# EAGLE schematic 1 (EAGLE 9.3.2)
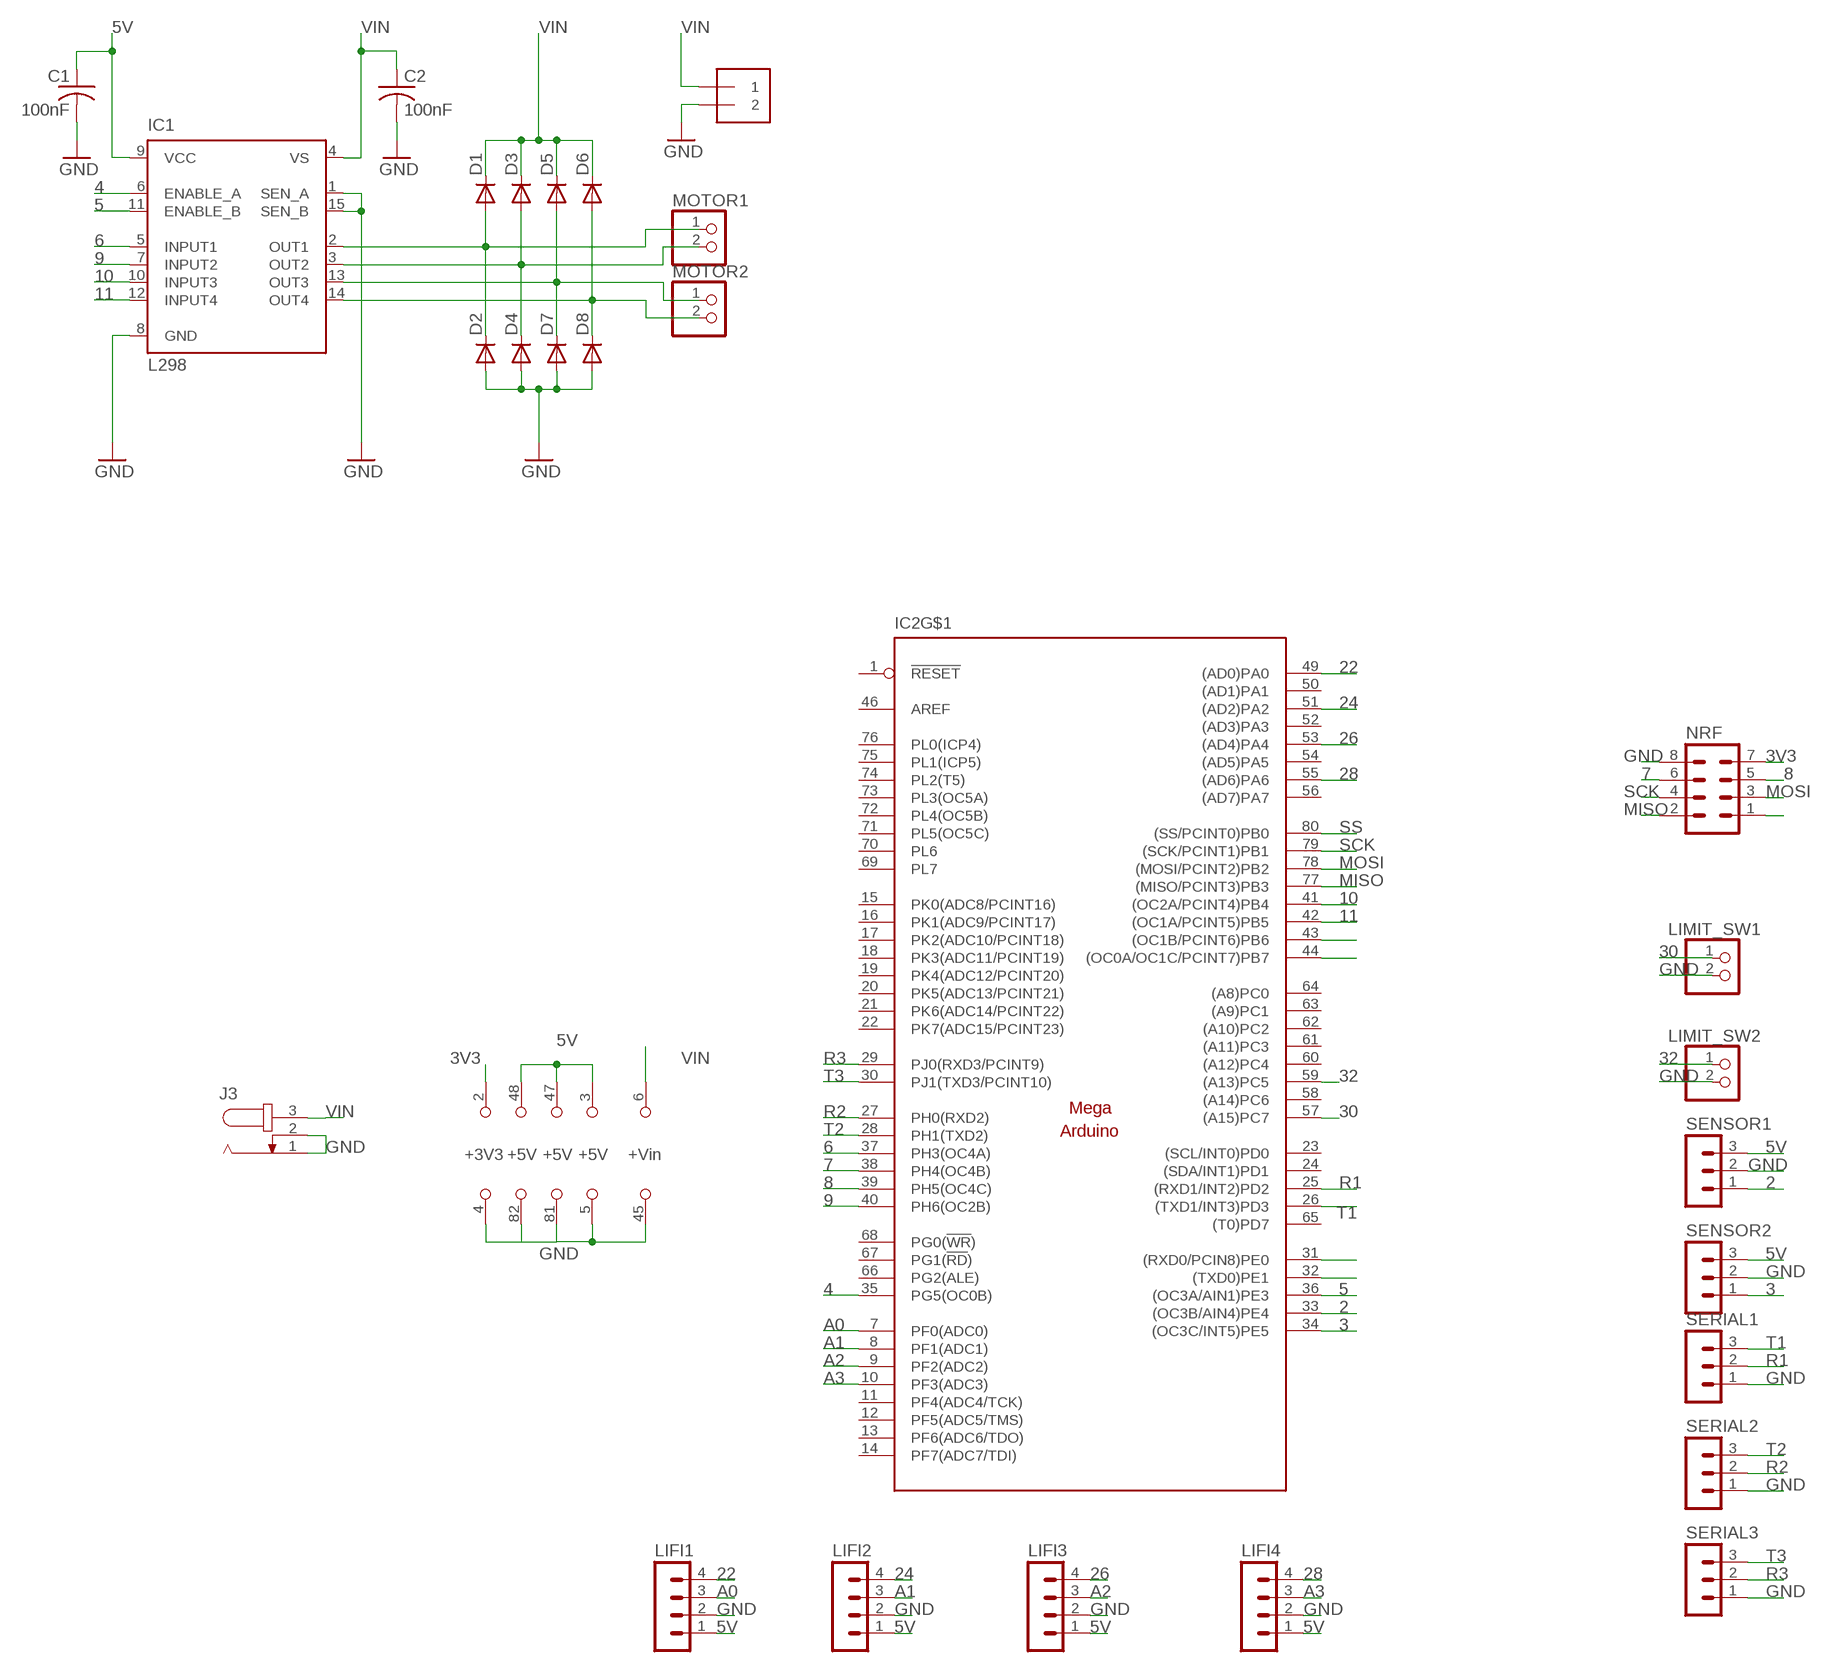
[diagram p0: schematic, sheet 1]

## Parts
C1  100nF  C-US050-024X044  [C050-024X044]
C2  100nF  C-US050-024X044  [C050-024X044]
D1  DIODE-D-5  [D-5]
D2  DIODE-D-5  [D-5]
D3  DIODE-D-5  [D-5]
D4  DIODE-D-5  [D-5]
D5  DIODE-D-5  [D-5]
D6  DIODE-D-5  [D-5]
D7  DIODE-D-5  [D-5]
D8  DIODE-D-5  [D-5]
IC1  L298  [MULTIWATT-15]
IC2  MEGAARDUINO_21  [MEGA_ARDUINO_1]
J1  1X2-3.5MM  [1X2-3.5MM]
J3  JACK-PLUG0  [SPC4077]
LIFI1  MA04-1  [MA04-1]
LIFI2  MA04-1  [MA04-1]
LIFI3  MA04-1  [MA04-1]
LIFI4  MA04-1  [MA04-1]
LIMIT_SW1  PINHD-1X2  [1X02]
LIMIT_SW2  PINHD-1X2  [1X02]
MOTOR1  PINHD-1X2  [1X02]
MOTOR2  PINHD-1X2  [1X02]
NRF  MA04-2  [MA04-2]
SENSOR1  MA03-1  [MA03-1]
SENSOR2  MA03-1  [MA03-1]
SERIAL1  MA03-1  [MA03-1]
SERIAL2  MA03-1  [MA03-1]
SERIAL3  MA03-1  [MA03-1]

## Nets
2: IC2.33((OC3B/AIN4)PE4) SENSOR1.1
3: IC2.34((OC3C/INT5)PE5) SENSOR2.1
3V3: IC2.2(+3V3) NRF.7
4: IC1.6(ENABLE_A) IC2.35(PG5(OC0B))
5: IC1.11(ENABLE_B) IC2.36((OC3A/AIN1)PE3)
5V: C1.1 IC1.9(VCC) IC2.3(+5V) IC2.47(+5V) IC2.48(+5V) LIFI1.1 LIFI2.1 LIFI3.1 LIFI4.1 SENSOR1.3 SENSOR2.3
6: IC1.5(INPUT1) IC2.37(PH3(OC4A))
7: IC2.38(PH4(OC4B)) NRF.6
8: IC2.39(PH5(OC4C)) NRF.5
9: IC1.7(INPUT2) IC2.40(PH6(OC2B))
10: IC1.10(INPUT3) IC2.41((OC2A/PCINT4)PB4)
11: IC1.12(INPUT4) IC2.42((OC1A/PCINT5)PB5)
22: IC2.49((AD0)PA0) LIFI1.4
24: IC2.51((AD2)PA2) LIFI2.4
26: IC2.53((AD4)PA4) LIFI3.4
28: IC2.55((AD6)PA6) LIFI4.4
30: IC2.57((A15)PC7) LIMIT_SW1.1
32: IC2.59((A13)PC5) LIMIT_SW2.1
A0: IC2.7(PF0(ADC0)) LIFI1.3
A1: IC2.8(PF1(ADC1)) LIFI2.3
A2: IC2.9(PF2(ADC2)) LIFI3.3
A3: IC2.10(PF3(ADC3)) LIFI4.3
GND: C1.2 C2.2 D2.A D4.A D7.A D8.A IC1.1(SEN_A) IC1.8(GND) IC1.15(SEN_B) IC2.4(GND) IC2.5(GND) IC2.45(GND) IC2.81(GND) IC2.82(GND) J1.2 J3.1 J3.2 LIFI1.2 LIFI2.2 LIFI3.2 LIFI4.2 LIMIT_SW1.2 LIMIT_SW2.2 NRF.8 SENSOR1.2 SENSOR2.2 SERIAL1.1 SERIAL2.1 SERIAL3.1
MISO: IC2.77((MISO/PCINT3)PB3) NRF.2
MOSI: IC2.78((MOSI/PCINT2)PB2) NRF.3
N$1: D1.A D2.C IC1.2(OUT1) MOTOR1.1
N$2: D3.A D4.C IC1.3(OUT2) MOTOR1.2
N$3: D6.A D8.C IC1.14(OUT4) MOTOR2.2
N$4: D5.A D7.C IC1.13(OUT3) MOTOR2.1
N$17: IC2.43((OC1B/PCINT6)PB6)
N$18: IC2.44((OC0A/OC1C/PCINT7)PB7)
N$22: NRF.1
N$30: IC2.31((RXD0/PCIN8)PE0)
N$31: IC2.32((TXD0)PE1)
R1: IC2.25((RXD1/INT2)PD2) SERIAL1.2
R2: IC2.27(PH0(RXD2)) SERIAL2.2
R3: IC2.29(PJ0(RXD3/PCINT9)) SERIAL3.2
SCK: IC2.79((SCK/PCINT1)PB1) NRF.4
SS: IC2.80((SS/PCINT0)PB0)
T1: IC2.26((TXD1/INT3)PD3) SERIAL1.3
T2: IC2.28(PH1(TXD2)) SERIAL2.3
T3: IC2.30(PJ1(TXD3/PCINT10)) SERIAL3.3
VIN: C2.1 D1.C D3.C D5.C D6.C IC1.4(VS) IC2.6(+VIN) J1.1 J3.3
Unconnected: IC2.1(!RESET) IC2.11(PF4(ADC4/TCK)) IC2.12(PF5(ADC5/TMS)) IC2.13(PF6(ADC6/TDO)) IC2.14(PF7(ADC7/TDI)) IC2.15(PK0(ADC8/PCINT16)) IC2.16(PK1(ADC9/PCINT17)) IC2.17(PK2(ADC10/PCINT18)) IC2.18(PK3(ADC11/PCINT19)) IC2.19(PK4(ADC12/PCINT20)) IC2.20(PK5(ADC13/PCINT21)) IC2.21(PK6(ADC14/PCINT22)) IC2.22(PK7(ADC15/PCINT23)) IC2.23((SCL/INT0)PD0) IC2.24((SDA/INT1)PD1) IC2.46(AREF) IC2.50((AD1)PA1) IC2.52((AD3)PA3) IC2.54((AD5)PA5) IC2.56((AD7)PA7) IC2.58((A14)PC6) IC2.60((A12)PC4) IC2.61((A11)PC3) IC2.62((A10)PC2) IC2.63((A9)PC1) IC2.64((A8)PC0) IC2.65((T0)PD7) IC2.66(PG2(ALE)) IC2.67(PG1(!RD!)) IC2.68(PG0(!WR!)) IC2.69(PL7) IC2.70(PL6) IC2.71(PL5(OC5C)) IC2.72(PL4(OC5B)) IC2.73(PL3(OC5A)) IC2.74(PL2(T5)) IC2.75(PL1(ICP5)) IC2.76(PL0(ICP4))

## Library data of the parts
C1 C2 = rcl:C-US: CAPACITOR, American symbol
D1-D8 = diode:DIODE-: DIODE
IC1 = st-microelectronics:L298: DUAL FULL-BRIDGE DRIVER; MPN: L298N; OC_FARNELL: 1589425; OC_NEWARK: 32M1527
IC2 = arduino:MEGAARDUINO_2: The Arduino Mega is a microcontroller board based on the ATmega1280. - 54 digital input/output pins (of which 14 can be used as PWM outputs) - 16 analog inputs - 4 UARTs (hardware serial ports) - 16 MHz crystal oscillator - USB connection - power jack - ICSP header - reset button It contains everything needed to support the microcontroller; simply connect it to a computer with a USB cable or power it with a AC-to-DC adapter or battery to get started. The Mega is compatible with most shields designed for the Arduino Duemilanove or Diecimila. http://arduino.cc/en/Main/ArduinoBoardMega
J1 = adafruit:1X2: 3.5mm Terminal block http://www.ladyada.net/library/pcb/eaglelibrary.html
J3 = con-jack:JACK-PLUG: DC POWER JACK Power Jack, DC, Right Angle, Through Hole, Rated 5A at 16VDC, PC Terminals Distributor: Farnell (www.Farnell.de) Drawing: 84N1161.pdf / 84N1162.pdf Manufacturer: SPC Technology (www.spctechnology.com) Type: SPC4077 / SPC 4078; OC_FARNELL: unknown; OC_NEWARK: unknown
LIFI1-LIFI4 = con-lstb:MA04-1: PIN HEADER; OC_FARNELL: unknown; OC_NEWARK: unknown
LIMIT_SW1 LIMIT_SW2 MOTOR1 MOTOR2 = pinhead:PINHD-1X2: PIN HEADER
NRF = con-lstb:MA04-2: PIN HEADER; OC_FARNELL: unknown; OC_NEWARK: unknown
SENSOR1 SENSOR2 SERIAL1-SERIAL3 = con-lstb:MA03-1: PIN HEADER; OC_FARNELL: unknown; OC_NEWARK: unknown